# EAGLE design Nixie_noTube_final_R2_1 (EAGLE 7.6.0)
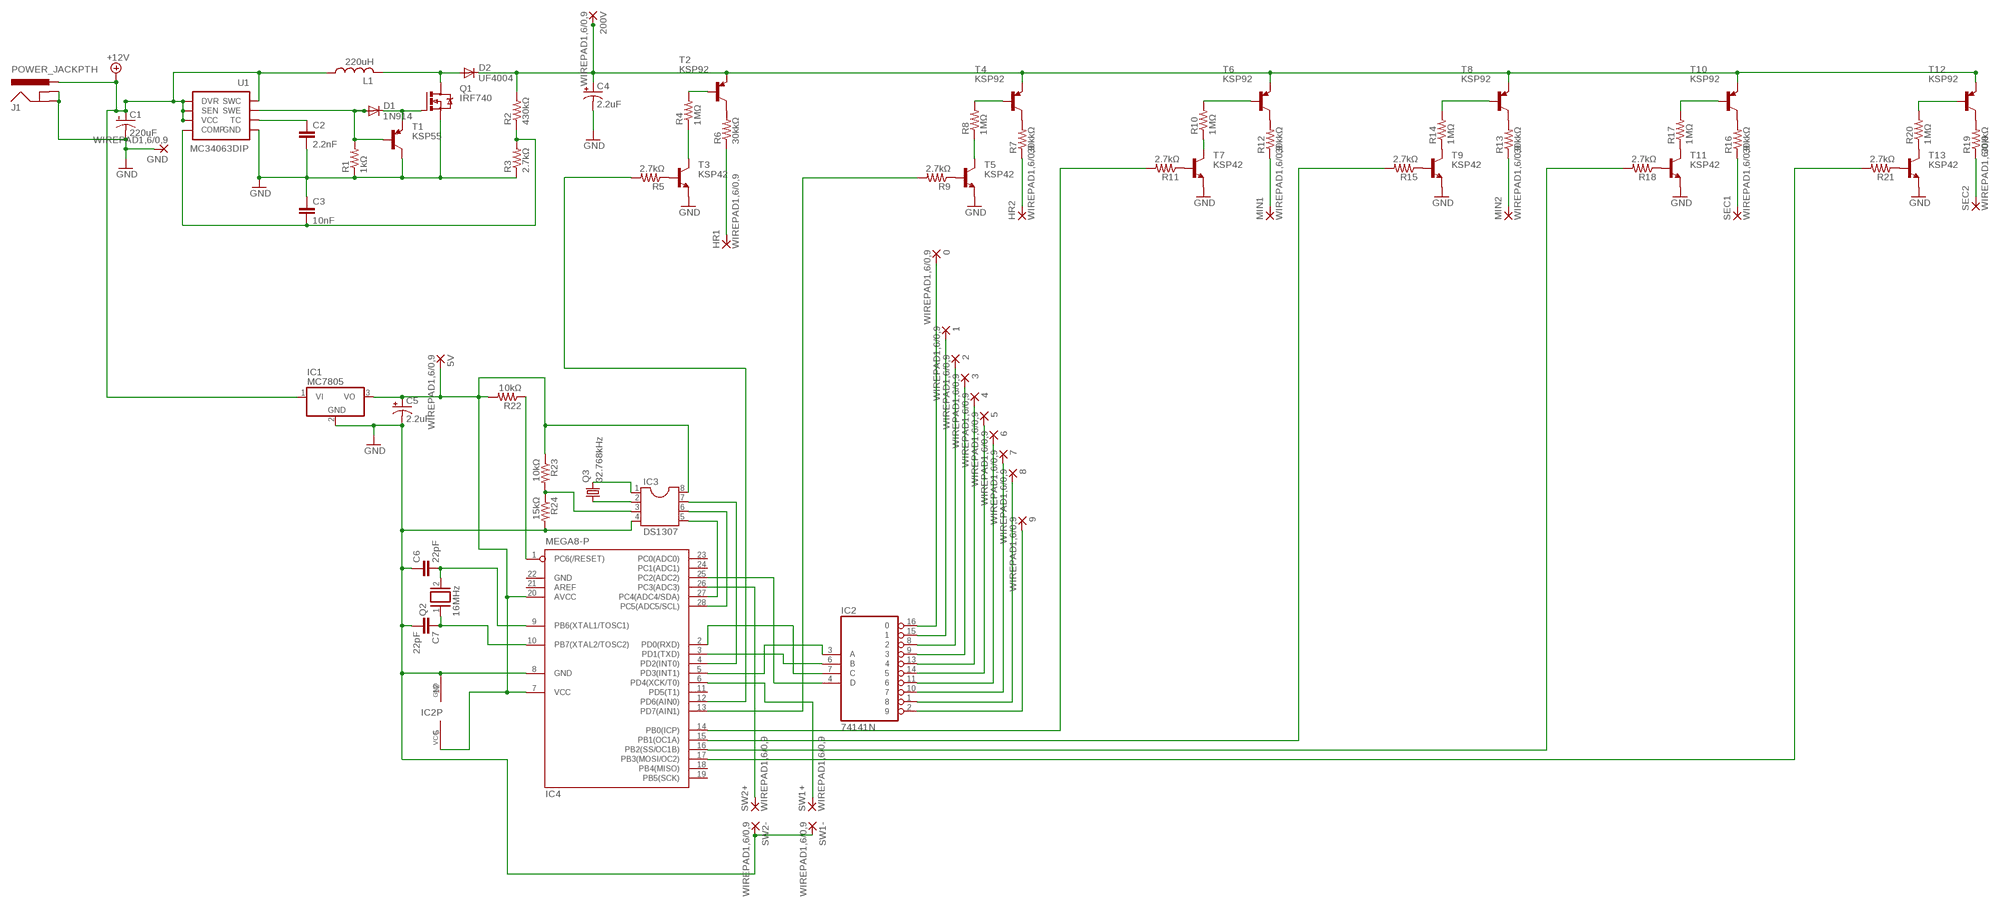
[diagram p0: schematic, sheet 1]

## Parts
0  WIREPAD1,6/0,9  [1,6/0,9]
1  WIREPAD1,6/0,9  [1,6/0,9]
2  WIREPAD1,6/0,9  [1,6/0,9]
3  WIREPAD1,6/0,9  [1,6/0,9]
4  WIREPAD1,6/0,9  [1,6/0,9]
5  WIREPAD1,6/0,9  [1,6/0,9]
5V  WIREPAD1,6/0,9  [1,6/0,9]
6  WIREPAD1,6/0,9  [1,6/0,9]
7  WIREPAD1,6/0,9  [1,6/0,9]
8  WIREPAD1,6/0,9  [1,6/0,9]
9  WIREPAD1,6/0,9  [1,6/0,9]
200V  WIREPAD1,6/0,9  [1,6/0,9]
C1  220uF  CPOL-USE5-10.5  [E5-10,5]
C2  2.2nF  CAPEZ  [CAP-PTH-SMALLEZ]
C3  10nF  CAPEZ  [CAP-PTH-SMALLEZ]
C4  2.2uF  CAP_POLPTH1  [CPOL-RADIAL-100UF-25V]
C5  2.2uF  CAP_POLPTH1  [CPOL-RADIAL-100UF-25V]
C6  22pF  C2,5-3  [C2.5-3]
C7  22pF  C2,5-3  [C2.5-3]
D1  1N914  1N4004  [DO41-10]
D2  UF4004  1N4004  [DO41-10]
GND  WIREPAD1,6/0,9  [1,6/0,9]
HR1  WIREPAD1,6/0,9  [1,6/0,9]
HR2  WIREPAD1,6/0,9  [1,6/0,9]
IC1  MC7805  7805TV  [TO220V]
IC2  74141N  [DIL16]
IC3  DS1307  DIL8  [DIL08]
IC4  MEGA8-P  [DIL28-3]
J1  POWER_JACKPTH  [POWER_JACK_PTH]
L1  220uH  L-US6000-XXX-RC  [6000-XXXX-RC]
MIN1  WIREPAD1,6/0,9  [1,6/0,9]
MIN2  WIREPAD1,6/0,9  [1,6/0,9]
Q1  IRF740  [TO220BV]
Q2  16MHz  XTAL/S  [QS]
Q3  32.768kHz  CRYSTALTC26H  [TC26H]
R1  1kΩ  R-US_0204/7  [0204/7]
R2  430kΩ  R-US_0204/7  [0204/7]
R3  2.7kΩ  R-US_0204/7  [0204/7]
R4  1MΩ  R-US_0204/7  [0204/7]
R5  2.7kΩ  R-US_0204/7  [0204/7]
R6  30kkΩ  R-US_0204/7  [0204/7]
R7  30kkΩ  R-US_0204/7  [0204/7]
R8  1MΩ  R-US_0204/7  [0204/7]
R9  2.7kΩ  R-US_0204/7  [0204/7]
R10  1MΩ  R-US_0204/7  [0204/7]
R11  2.7kΩ  R-US_0204/7  [0204/7]
R12  30kkΩ  R-US_0204/7  [0204/7]
R13  30kkΩ  R-US_0204/7  [0204/7]
R14  1MΩ  R-US_0204/7  [0204/7]
R15  2.7kΩ  R-US_0204/7  [0204/7]
R16  30kkΩ  R-US_0204/7  [0204/7]
R17  1MΩ  R-US_0204/7  [0204/7]
R18  2.7kΩ  R-US_0204/7  [0204/7]
R19  30kkΩ  R-US_0204/7  [0204/7]
R20  1MΩ  R-US_0204/7  [0204/7]
R21  2.7kΩ  R-US_0204/7  [0204/7]
R22  10kΩ  R-US_0204/7  [0204/7]
R23  10kΩ  R-US_0204/7  [0204/7]
R24  15kΩ  R-US_0204/7  [0204/7]
SEC1  WIREPAD1,6/0,9  [1,6/0,9]
SEC2  WIREPAD1,6/0,9  [1,6/0,9]
SW1+  WIREPAD1,6/0,9  [1,6/0,9]
SW1-  WIREPAD1,6/0,9  [1,6/0,9]
SW2+  WIREPAD1,6/0,9  [1,6/0,9]
SW2-  WIREPAD1,6/0,9  [1,6/0,9]
T1  KSP55  -PNP-TO92-EBC  [TO92-EBC]
T2  KSP92  BC328-40-PNP-TO92-EBC  [TO92-EBC]
T3  KSP42  29-NPN-TO92-EBC  [TO92-EBC]
T4  KSP92  BC328-40-PNP-TO92-EBC  [TO92-EBC]
T5  KSP42  29-NPN-TO92-EBC  [TO92-EBC]
T6  KSP92  BC328-40-PNP-TO92-EBC  [TO92-EBC]
T7  KSP42  29-NPN-TO92-EBC  [TO92-EBC]
T8  KSP92  BC328-40-PNP-TO92-EBC  [TO92-EBC]
T9  KSP42  29-NPN-TO92-EBC  [TO92-EBC]
T10  KSP92  BC328-40-PNP-TO92-EBC  [TO92-EBC]
T11  KSP42  29-NPN-TO92-EBC  [TO92-EBC]
T12  KSP92  BC328-40-PNP-TO92-EBC  [TO92-EBC]
T13  KSP42  29-NPN-TO92-EBC  [TO92-EBC]
U1  MC34063DIP  [DIP-08]

## Nets
3V: IC3.3 R23.2 R24.1
5V: 5V.1(P) C5.1(+) IC1.3(VO) IC2.5(VCC) IC3.8 IC4.7(VCC) IC4.20(AVCC) R22.2 R23.1
200V: 200V.1(P) C4.1(+) D2.C R2.2 T2.E T4.E T6.E T8.E T10.E T12.E
+12V: C1.+ IC1.1(VI) J1.PWR L1.1 U1.1(SWC) U1.6(VCC) U1.7(SEN) U1.8(DVR)
GND: C1.- C2.2 C3.1 C4.2(-) C5.2(-) C6.1 C7.2 GND.1(P) IC1.2(GND) IC2.12(GND) IC3.4 IC4.8(GND) J1.GND J1.GNDBREAK Q1.S R1.1 R3.1 R24.2 SW1-.1(P) SW2-.1(P) T1.C T3.E T5.E T7.E T9.E T11.E T13.E U1.4(GND)
H1: HR2.1(P) R7.1
N$1: C2.1 U1.3(TC)
N$2: C3.2 R2.1 R3.2 U1.5(COMP)
N$3: D1.A R1.2 T1.B U1.2(SWE)
N$4: D1.C Q1.G T1.E
N$5: D2.A L1.2 Q1.D
N$6: R19.1 SEC2.1(P)
N$7: R11.1 T7.B
N$8: R6.2 T2.C
N$9: R4.2 T2.B
N$10: R4.1 T3.C
N$11: R5.1 T3.B
N$12: HR1.1(P) R6.1
N$13: R7.2 T4.C
N$14: R9.1 T5.B
N$15: R8.2 T4.B
N$16: R8.1 T5.C
N$17: IC3.1 Q3.2
N$18: R12.2 T6.C
N$19: R10.1 T7.C
N$20: MIN1.1(P) R12.1
N$21: R10.2 T6.B
N$22: R13.2 T8.C
N$23: R14.1 T9.C
N$24: R15.1 T9.B
N$25: R14.2 T8.B
N$26: MIN2.1(P) R13.1
N$27: R16.2 T10.C
N$28: R17.1 T11.C
N$29: R18.1 T11.B
N$30: R17.2 T10.B
N$31: R16.1 SEC1.1(P)
N$32: R19.2 T12.C
N$33: R20.1 T13.C
N$34: R21.1 T13.B
N$35: R20.2 T12.B
N$36: IC3.2 Q3.1
N$37: IC4.1(PC6(/RESET)) R22.1
N$39: IC2.6(B) IC4.3(PD1(TXD))
N$40: C6.2 IC4.9(PB6(XTAL1/TOSC1)) Q2.2
N$41: C7.1 IC4.10(PB7(XTAL2/TOSC2)) Q2.1
N$42: IC2.7(C) IC4.2(PD0(RXD))
N$43: IC2.4(D) IC4.25(PC2(ADC2))
N$44: IC2.3(A) IC4.5(PD3(INT1))
N$45: 0.1(P) IC2.16
N$46: 1.1(P) IC2.15
N$47: 2.1(P) IC2.8
N$48: 3.1(P) IC2.9
N$49: 4.1(P) IC2.13
N$50: 5.1(P) IC2.14
N$51: 6.1(P) IC2.11
N$52: 7.1(P) IC2.10
N$53: 8.1(P) IC2.1
N$54: 9.1(P) IC2.2
N$55: IC4.6(PD4(XCK/T0)) SW1+.1(P)
N$56: IC4.26(PC3(ADC3)) SW2+.1(P)
N$57: IC4.12(PD6(AIN0)) R5.2
N$58: IC4.13(PD7(AIN1)) R9.2
N$59: IC4.14(PB0(ICP)) R11.2
N$60: IC4.15(PB1(OC1A)) R15.2
N$61: IC4.16(PB2(SS/OC1B)) R18.2
N$62: IC4.17(PB3(MOSI/OC2)) R21.2
SCL: IC3.6 IC4.28(PC5(ADC5/SCL))
SDA: IC3.5 IC4.27(PC4(ADC4/SDA))
SQWOUT: IC3.7 IC4.4(PD2(INT0))
Unconnected: IC4.11(PD5(T1)) IC4.18(PB4(MISO)) IC4.19(PB5(SCK)) IC4.21(AREF) IC4.23(PC0(ADC0)) IC4.24(PC1(ADC1))

## Power pins joined to a net without a drawn wire
GND: IC4.22(GND)

## Library data of the parts
0 1-5 5V 6-9 200V GND HR1 HR2 MIN1 MIN2 SEC1 SEC2 SW1+ SW1- SW2+ SW2- = wirepad:WIREPAD: Wire PAD connect wire on PCB
C1 = resistor:CPOL-US: POLARIZED CAPACITOR, American symbol
C2 C3 = SparkFun-Capacitors:CAP: Capacitor Standard 0603 ceramic capacitor, and 0.1" leaded capacitor.
C4 C5 = SparkFun-Capacitors:CAP_POL: Capacitor Polarized These are standard SMD and PTH capacitors. Normally 10uF, 47uF, and 100uF in electrolytic and tantalum varieties. Always verify the external diameter of the through hole cap, it varies with capacity, voltage, and manufacturer. The EIA devices should be standard.
C6 C7 = capacitor-wima:C: CAPACITOR naming: grid - package width
D1 D2 = diode:1N4004: DIODE general purpose rectifier, 1 A
IC1 = linear:78*: Positive VOLTAGE REGULATOR Source: http://cache.national.com/ds/LM/LM78L05.pdf http://www.fairchildsemi.com/ds/LM/LM7805.pdf
IC2 = 74xx-us:74*141: BCD to decimal DECODER/DRIVER
IC3 = ic-package:DIL8: Dual In Line / Socket
IC4 = atmel:MEGA8-P: MICROCONTROLLER 8 Kbytes FLASH, 1 kbytes SRAM, 512 bytes EEPROM, USART, 4-channel 10 bit ADC, 2-channel 8 bit ADC Pin compatible with Atmega48, ATMega88, ATMega168 Source: avr.lbr; OC_FARNELL: unknown; OC_NEWARK: unknown
J1 = SparkFun-Connectors:POWER_JACK: Power Jack This is the standard 5.5mm barrel jack for power. The PTH is the most common, proven, reliable, footprint. The Slot footprint only works if the mill layer is transmitted to the PCB fab house so be warned. Mating wall wart : TOL-00298 (and others); PROD_ID: CONN-08197
L1 = rcl:L-US: INDUCTOR, American symbol
Q1 = transistor-power:IRF740: N-CHANNEL MOS FET
Q2 = special:XTAL/S: CRYSTAL
Q3 = crystal:CRYSTAL: CRYSTAL; OC_FARNELL: unknown; OC_NEWARK: unknown
R1-R24 = resistor:R-US_: RESISTOR, American symbol
T1 = transistor-neu-to92:*-PNP-: PNP Transistror
T2 T4 T6 T8 T10 T12 = transistor:*-PNP-: PNP Transistror
T3 T5 T7 T9 T11 T13 = transistor:*-NPN-: NPN Transistror BF959 corrected 2008.03.06
U1 = SparkFun-PowerIC:MC34063: Jellybean switching supply controller

## Board
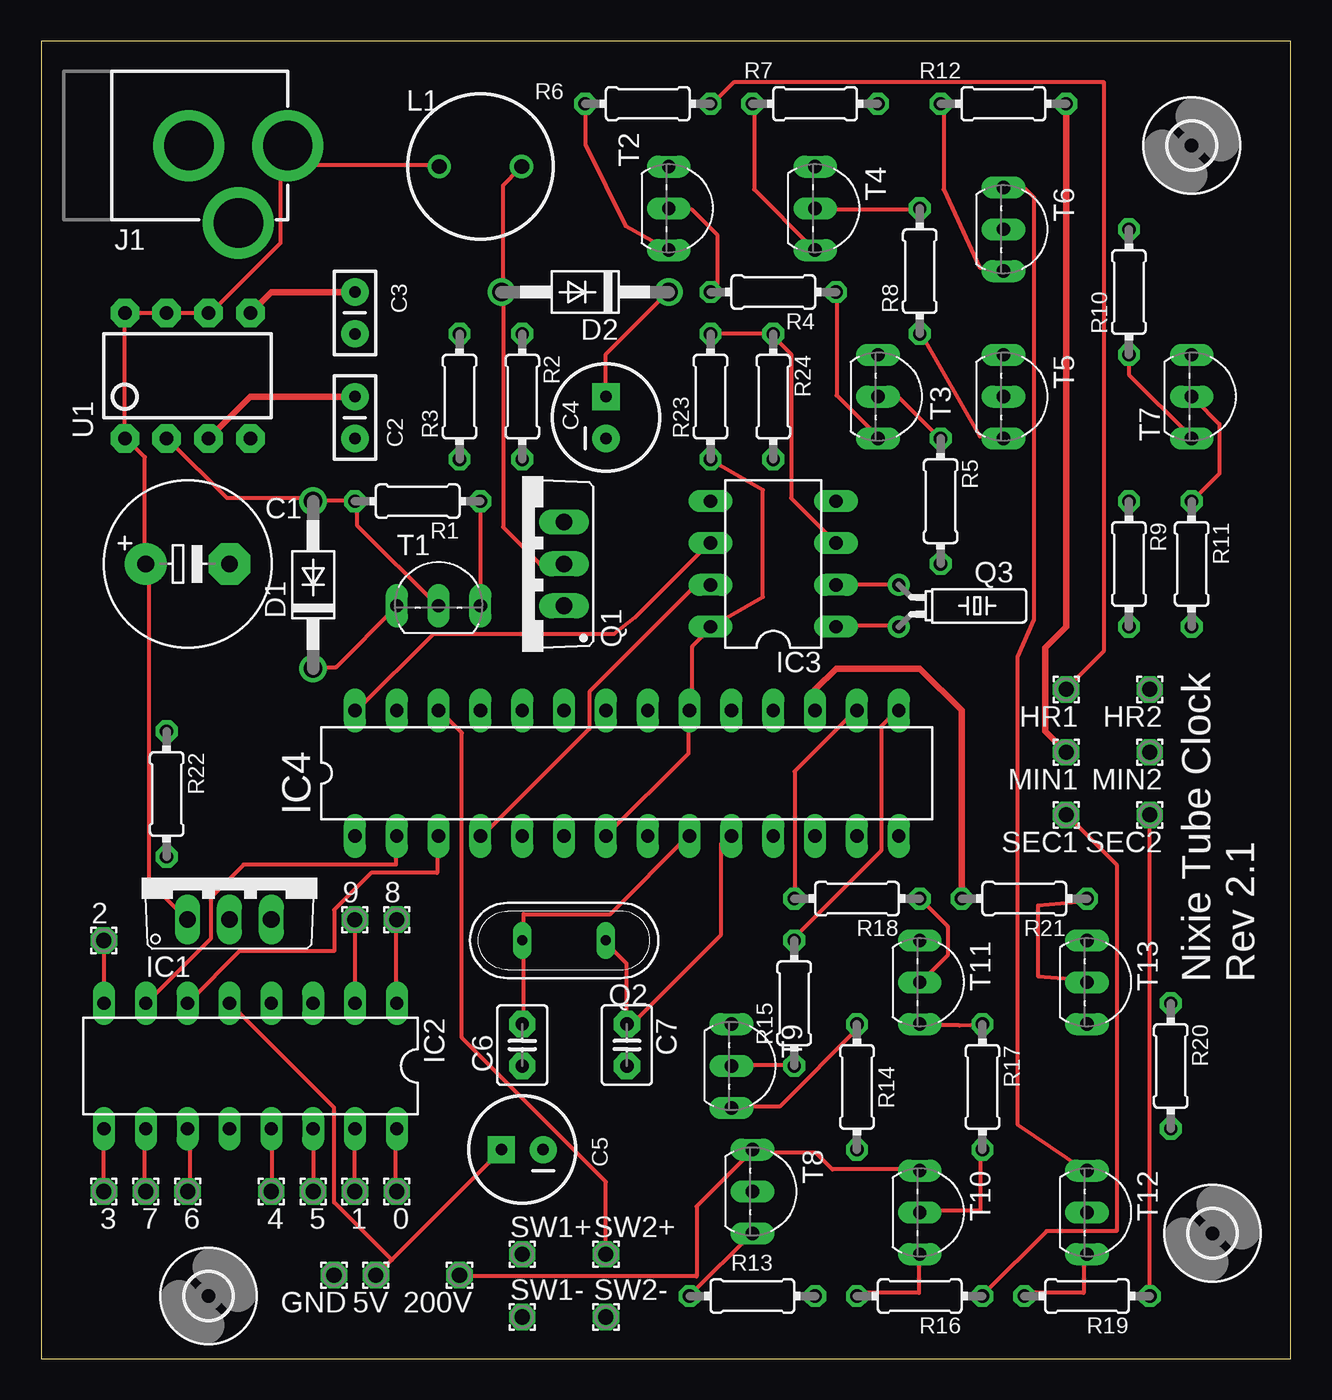
[diagram p1: board, top side]
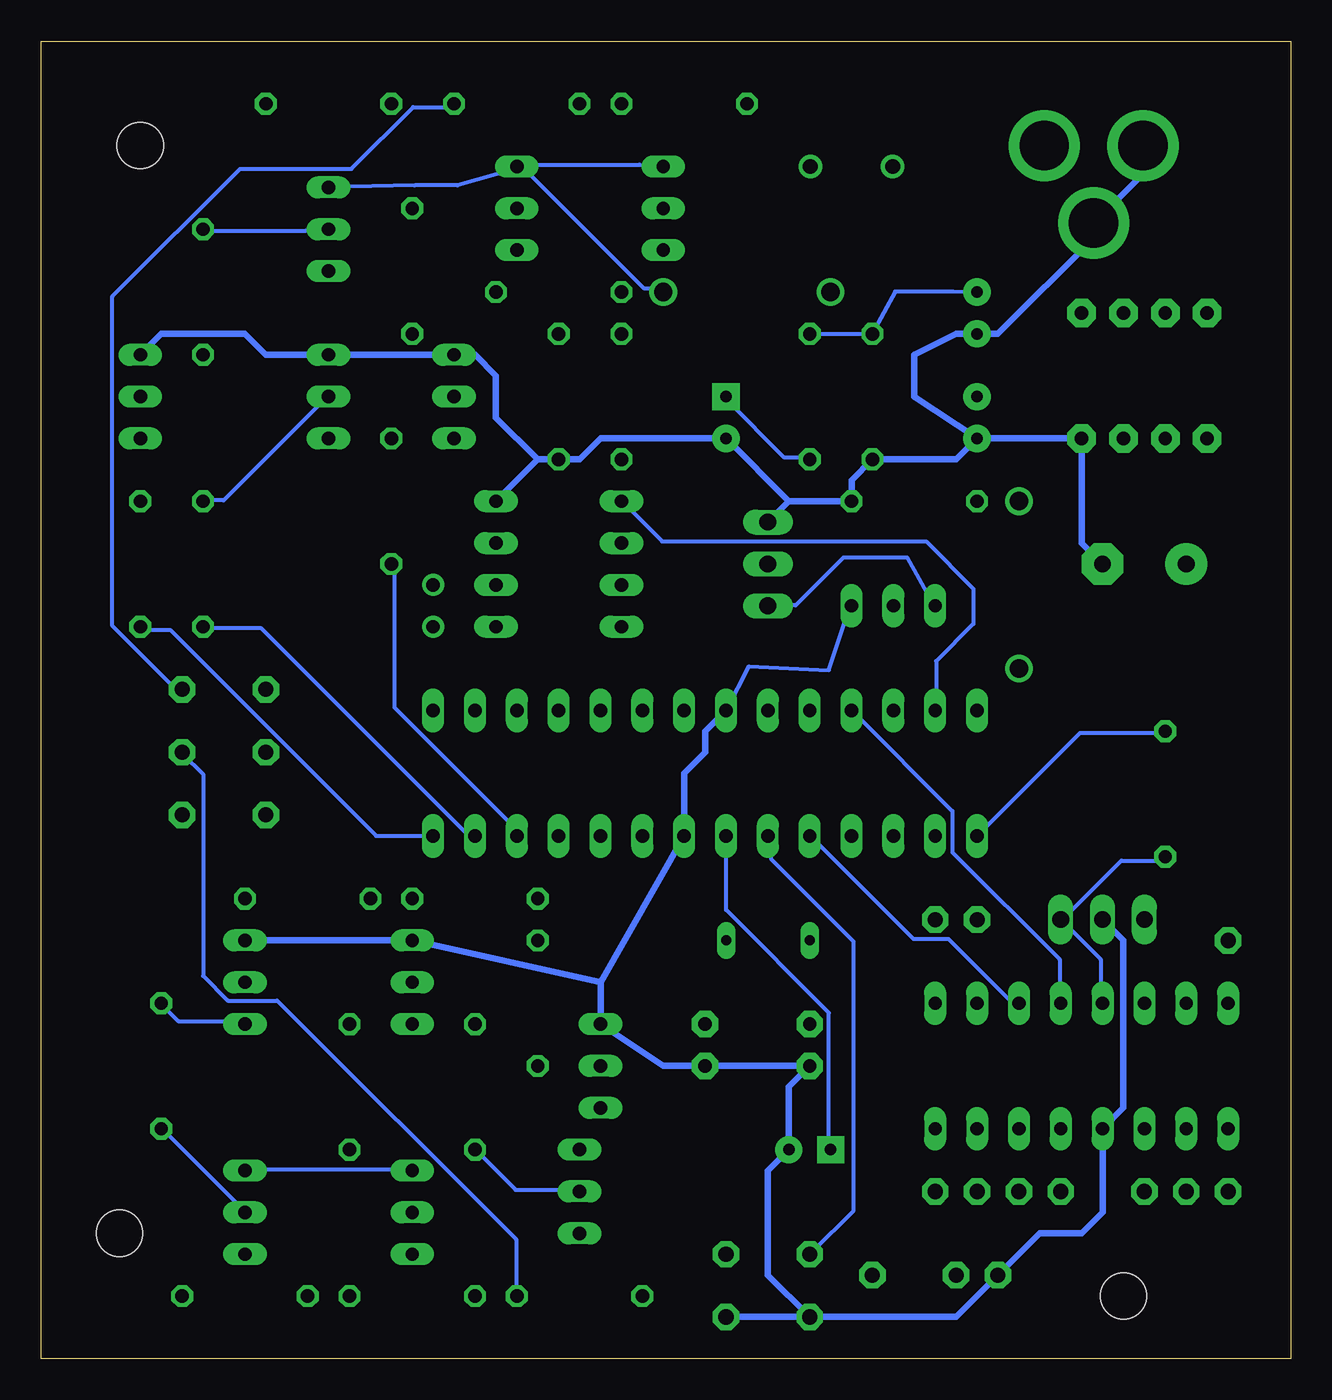
[diagram p2: board, bottom side, seen from below]

Size 75.87 x 80 mm. Coordinates in mm from the lower left corner, seen from the top.
Outline: 0,0 75.87,0 75.87,80 0,80 0,0
Copper layers (1*16): Top 0.035mm / dielectric 1.5mm / Bottom 0.035mm
Design rules "default": minimum track width 10mil, minimum drill 24mil, track to track 8mil, track to pad 8mil, pad to pad 8mil, via to via 8mil, smd to smd 8mil, copper to edge 40mil, drill to drill 8mil, minimum pad ring 10mil, minimum via ring 8mil, stop-mask expansion 4mil, vias tented up to drill 0mil, thermal gap 10mil

### Footprints (pad centres in the part's own frame; a part is rotated, then mirrored left to right if it is on the bottom)
1,6/0,9 = drill 0.914 pad 1.6 octagon: 1 0,0
E5-10,5 = drill 1.016 pad 2.54: + -2.54,0 | drill 1.016 pad 2.54 octagon: - 2.54,0
CAP-PTH-SMALLEZ = drill 0.7 pad 1.651: 1 0,0; 2 2.54,0
CPOL-RADIAL-100UF-25V = drill 0.7 pad 1.651 square: 1 1.27,0 | drill 0.7 pad 1.651: 2 -1.27,0
C2.5-3 = drill 0.813 pad 1.6 octagon: 1 -1.27,0; 2 1.27,0
DO41-10 = drill 1.118: A 5.08,0; C -5.08,0
TO220V = drill 1.016 long: 1 -2.54,-2.54; 2 0,-2.54; 3 2.54,-2.54
DIL16 = drill 0.813 long: 1 -8.89,-3.81; 2 -6.35,-3.81; 3 -3.81,-3.81; 4 -1.27,-3.81; 5 1.27,-3.81; 6 3.81,-3.81; 7 6.35,-3.81; 8 8.89,-3.81; 9 8.89,3.81; 10 6.35,3.81; 11 3.81,3.81; 12 1.27,3.81; 13 -1.27,3.81; 14 -3.81,3.81; 15 -6.35,3.81; 16 -8.89,3.81
DIL08 = drill 0.813 long: 1 -3.81,-3.81; 2 -1.27,-3.81; 3 1.27,-3.81; 4 3.81,-3.81; 5 3.81,3.81; 6 1.27,3.81; 7 -1.27,3.81; 8 -3.81,3.81
DIL28-3 = drill 0.813 long: 1 -16.51,-3.81; 2 -13.97,-3.81; 3 -11.43,-3.81; 4 -8.89,-3.81; 5 -6.35,-3.81; 6 -3.81,-3.81; 7 -1.27,-3.81; 8 1.27,-3.81; 9 3.81,-3.81; 10 6.35,-3.81; 11 8.89,-3.81; 12 11.43,-3.81; 13 13.97,-3.81; 14 16.51,-3.81; 15 16.51,3.81; 16 13.97,3.81; 17 11.43,3.81; 18 8.89,3.81; 19 6.35,3.81; 20 3.81,3.81; 21 1.27,3.81; 22 -1.27,3.81; 23 -3.81,3.81; 24 -6.35,3.81; 25 -8.89,3.81; 26 -11.43,3.81; 27 -13.97,3.81; 28 -16.51,3.81
POWER_JACK_PTH = drill 2.997 pad 4.318: GND 0,7.7; GNDBREAK 4.7,10.7; PWR 0,13.7
6000-XXXX-RC = drill 0.9 pad 1.422: 1 -2.5,0; 2 2.5,0
TO220BV = drill 1.016 long: D 0,-2.54; G -2.54,-2.54; S 2.54,-2.54
QS = drill 0.61 long: 1 -2.54,0; 2 2.54,0
TC26H = drill 0.813: 1 -1.27,0; 2 1.27,0
0204/7 = drill 0.813 octagon: 1 -3.81,0; 2 3.81,0
TO92-EBC = drill 0.813 long: B 0,-1.27; C 2.54,-1.27; E -2.54,-1.27
DIP-08 = drill 0.813 pad 1.727 octagon: 1 -3.81,-3.81; 2 -1.27,-3.81; 3 1.27,-3.81; 4 3.81,-3.81; 5 3.81,3.81; 6 1.27,3.81; 7 -1.27,3.81; 8 -3.81,3.81
2,8 = hole 2.8: 0,0

### Placement (x,y rotation side)
0  21.59,10.16 180 top
1  19.05,10.16 180 top
2  3.81,25.4 0 top
3  3.81,10.16 180 top
4  13.97,10.16 180 top
5  16.51,10.16 180 top
5V  20.32,5.08 180 top
6  8.89,10.16 180 top
7  6.35,10.16 180 top
8  21.59,26.67 0 top
9  19.05,26.67 0 top
200V  25.4,5.08 180 top
C1  8.89,48.26 0 top
C2  19.05,58.42 270 top
C3  19.05,62.23 90 top
C4  34.29,57.15 90 top
C5  29.21,12.7 180 top
C6  29.21,19.05 90 top
C7  35.56,19.05 270 top
D1  16.51,46.99 90 top
D2  33.02,64.77 180 top
GND  17.78,5.08 180 top
HR1  62.23,40.64 180 top
HR2  67.31,40.64 180 top
IC1  11.43,29.21 0 top
IC2  12.7,17.78 180 top
IC3  44.45,48.26 90 top
IC4  35.56,35.56 0 top
J1  1.27,73.66 270 top
L1  26.67,72.39 0 top
MIN1  62.23,36.83 180 top
MIN2  67.31,36.83 180 top
Q1  29.21,48.26 90 top
Q2  31.75,25.4 180 top
Q3  52.07,45.72 270 top
R1  22.86,52.07 180 top
R2  29.21,58.42 270 top
R3  25.4,58.42 90 top
R4  44.45,64.77 180 top
R5  54.61,52.07 270 top
R6  36.83,76.2 180 top
R7  46.99,76.2 180 top
R8  53.34,66.04 90 top
R9  66.04,48.26 270 top
R10  66.04,64.77 90 top
R11  69.85,48.26 270 top
R12  58.42,76.2 180 top
R13  43.18,3.81 180 top
R14  49.53,16.51 270 top
R15  45.72,21.59 90 top
R16  53.34,3.81 180 top
R17  57.15,16.51 270 top
R18  49.53,27.94 180 top
R19  63.5,3.81 180 top
R20  68.58,17.78 270 top
R21  59.69,27.94 180 top
R22  7.62,34.29 270 top
R23  40.64,58.42 90 top
R24  44.45,58.42 270 top
SEC1  62.23,33.02 180 top
SEC2  67.31,33.02 180 top
SW1+  29.21,6.35 0 top
SW1-  29.21,2.54 0 top
SW2+  34.29,6.35 0 top
SW2-  34.29,2.54 0 top
T1  24.13,46.99 0 top
T2  39.37,69.85 270 top
T3  52.07,58.42 270 top
T4  48.26,69.85 270 top
T5  59.69,58.42 270 top
T6  59.69,68.58 270 top
T7  71.12,58.42 270 top
T8  44.45,10.16 270 top
T9  43.18,17.78 270 top
T10  54.61,8.89 270 top
T11  54.61,22.86 270 top
T12  64.77,8.89 270 top
T13  64.77,22.86 270 top
U1  8.89,59.69 0 top
U$1  [2,8]  69.85,73.66 0 top
U$2  [2,8]  10.16,3.81 0 top
U$3  [2,8]  71.12,7.62 0 top

### Tracks (layer width: path | path; a pad name or v marks a point on that pad's centre or on a via)
3V
  Top 0.254: IC3.3 45.54,52.25 45.54,61 44.54,62 R24.1 44.29,62.25 40.79,62.25 R23.2
5V
  Top 0.254: IC4.7 39.29,36.75 39.29,39.25 IC4.20 39.54,39.5 39.54,43.25 40.54,44.25 IC3.8 40.79,44.5 43.81,46.25 43.81,52.75 40.79,54.5 R23.1 | 21.29,6 27.79,12.5 C5.1 | 21.29,6 20.54,5.25 5V.1 | 21.29,6 17.79,9.5 17.79,15.25 11.54,21.5 IC2.5
  Bottom 0.254: IC2.5 11.54,21.75 11.54,24.25 13.79,26.5 IC1.3 13.79,26.75 10.29,30.25 7.79,30.25 R22.2 | IC4.7 34.29,27.25 28.04,21 28.04,12.75 C5.1
200V
  Top 0.254: T10.E 53.29,11.5 48.04,11.5 47.04,12.5 43.29,12.5 T8.E 43.04,12.5 39.79,9.25 39.79,5 25.54,5 200V.1 | C4.1 34.29,61 38.04,64.75 D2.C | T12.E 63.29,11.5 59.27,14.25 59.27,42.61 60.27,44.88 60.27,70.52 59.79,71 T6.E
  Bottom 0.254: T10.E 53.54,11.5 63.29,11.5 T12.E | R2.2 29.29,54.75 30.79,54.75 34.29,58.25 C4.1 | 46.79,72.5 39.54,72.5 T2.E | T6.E 53.19,71.25 50.58,71.25 47.04,72.25 T4.E 46.79,72.5 | 46.79,72.5 39.29,65 38.29,65 D2.C
+12V
  Top 0.254: 15.04,72.5 24.04,72.5 L1.1 | 15.04,72.5 15.04,73.5 J1.PWR 15.04,72.5 | IC1.1 8.79,26.75 6.54,29 6.54,48.25 C1.+ 6.29,48.5 6.29,54.75 5.29,55.75 U1.1 5.04,56 5.04,63.5 U1.8 U1.7 U1.6 10.29,63.5 14.54,67.75 14.54,72 15.04,72.5
GND
  Top 0.254: T1.C 26.66,45.75 26.66,52 R1.1
  Bottom 0.254: T1.C 26.79,45.62 28.04,41.81 32.9,42.04 IC4.22
  Bottom 0.406: IC1.2 10.16,25.4 10.16,15.24 IC2.12 11.43,8.89 12.7,7.62 15.24,7.62 GND.1 20.32,2.54 SW1-.1 | SW2-.1 SW1-.1 | SW1-.1 31.75,5.08 31.75,11.43 C5.2 30.48,16.51 C6.1 C7.2 38.1,17.78 T9.E 41.91,22.86 | 41.91,22.86 T11.E T13.E | 41.91,22.86 IC4.8 36.83,35.56 35.56,36.83 35.56,38.1 IC4.22 | J1.GND 8.97,71.96 J1.GNDBREAK 11.97,68.04 17.78,62.23 C3.1 20.32,62.23 22.86,60.96 22.86,58.42 C2.2 | C2.2 20.32,54.61 R3.1 26.67,53.34 R1.1 30.48,52.07 | C2.2 U1.4 12.7,49.53 C1.- | 30.48,52.07 C4.2 41.91,55.88 43.18,54.61 R24.2 45.72,54.61 | Q1.S 30.48,52.07 | 45.72,54.61 IC3.4 | 45.72,54.61 48.26,57.15 48.26,59.69 49.53,60.96 T3.E T5.E 62.23,60.96 63.5,62.23 68.58,62.23 T7.E
H1
  Bottom 0.254: R7.1 51.04,76 53.29,76 57.04,72.25 63.79,72.25 71.54,64.5 71.54,44.5 67.54,40.5 HR2.1
N$1
  Top 0.406: U1.3 12.7,58.42 C2.1
N$2
  Top 0.406: U1.5 13.97,64.77 C3.2
  Bottom 0.254: R2.1 29.04,62.25 25.54,62.25 R3.2 24.02,64.79 20.52,64.79 19.29,64.75 C3.2
N$3
  Top 0.254: U1.2 7.79,55.75 11.29,52.25 16.29,52.25 D1.A 16.54,52.12 19.04,52.12 R1.2 19.16,52 19.16,50.62 24.04,45.75 T1.B
N$4
  Top 0.254: 16.54,42 D1.C 16.66,42 17.91,42 21.54,45.62 T1.E
  Bottom 0.254: Q1.G 31.66,45.75 30.06,45.75 27.16,48.65 23.29,48.65 21.66,45.75 T1.E
N$5
  Top 0.254: L1.2 29.04,72.25 28.04,71.25 28.04,65 D2.A 28.04,64.75 28.04,50.5 30.27,48.27 Q1.D
N$6
  Top 0.254: R19.1 67.29,4 67.29,33 SEC2.1
N$7
  Top 0.254: R11.1 70.04,52.25 71.54,53.75 71.54,56.75 70.04,58.25 T7.B
N$8
  Top 0.254: T2.C 35.48,68.77 33.04,73.75 33.04,76 R6.2
N$9
  Top 0.254: R4.2 40.79,65 41.04,65.25 41.04,68.25 39.54,69.75 T2.B
N$10
  Top 0.254: T3.C 50.79,56 48.29,58.5 48.29,64.75 R4.1
N$11
  Top 0.254: T3.B 51,58.29 52.15,58.29 54.43,56.01 R5.1
N$12
  Top 0.254: R6.1 40.79,76.25 42.04,77.5 64.54,77.5 64.54,43 62.29,40.75 HR1.1
N$13
  Top 0.254: T4.C 46.79,67.5 43.29,71 43.29,76 R7.2
N$14
  Bottom 0.254: R9.1 66.04,52.12 64.79,52.12 58.54,58.38 T5.B
N$15
  Top 0.254: T4.B 47.04,69.75 53.29,69.75 R8.2
N$16
  Top 0.254: R8.1 53.54,62 57,56 T5.C
N$17
  Top 0.254: IC3.1 48.29,44.5 52.04,44.5 Q3.2
N$18
  Top 0.254: T6.C 57,66.25 54.79,71 54.79,76 R12.2
N$19
  Top 0.254: R10.1 66.04,59.75 69.79,56 T7.C
N$20
  Top 0.406: R12.1 62.23,44.45 60.96,43.18 60.96,38.1 MIN1.1
N$21
  Bottom 0.254: T6.B 59.79,68.5 66.04,68.5 R10.2
N$22
  Top 0.254: R13.2 39.54,4 43.04,7.5 T8.C
N$23
  Top 0.254: T9.C 42.09,15.32 44.83,15.32 49.63,20.12 R14.1
N$24
  Top 0.254: T9.B 42.09,17.83 45.52,17.83 R15.1
N$25
  Bottom 0.254: T8.B 43.29,10.25 47.06,10.25 49.31,12.5 R14.2
N$26
  Bottom 0.254: R13.1 47.04,4 47.04,7.25 61.54,21.75 64.54,21.75 66.04,23.25 66.04,35.5 67.29,36.75 MIN2.1
N$27
  Top 0.254: R16.2 49.54,4 53.29,4 53.29,6.25 T10.C
N$28
  Top 0.254: T11.C 53.54,20.25 55.75,20.25 R17.1
N$29
  Top 0.254: T11.B 53.54,23 55.04,24.5 55.04,26.25 53.54,27.75 R18.1
N$30
  Top 0.254: T10.B 53.54,9 57.02,9 57.02,12.5 R17.2
N$31
  Top 0.254: R16.1 57.29,4 61.04,7.75 65.29,7.75 65.29,30 62.29,33 SEC1.1
N$32
  Top 0.254: R19.2 59.79,4 63.29,4 63.29,6.25 T12.C
N$33
  Bottom 0.254: T13.C 63.54,20.5 67.54,20.5 68.54,21.5 R20.1
N$34
  Top 0.254: T13.B 63.29,23 60.52,23.23 60.52,27.52 63.29,27.75 R21.1
N$35
  Bottom 0.254: T12.B 63.54,9 68.54,14 R20.2
N$36
  Top 0.254: IC3.2 48.29,47 52.04,47 Q3.1
N$37
  Bottom 0.254: R22.1 7.79,38 12.79,38 IC4.1
N$39
  Top 0.254: IC2.6 9.04,21.75 12.04,24.75 17.79,24.75 17.79,27.25 20.04,29.5 24.04,29.5 24.04,31.75 IC4.3
N$40
  Top 0.254: C6.2 29.29,20.5 29.29,25.25 Q2.2 29.29,25.5 29.29,27 34.54,27 39.29,31.75 IC4.9
N$41
  Top 0.254: Q2.1 34.29,25.25 35.54,24 35.54,20.5 C7.1 35.79,20.25 41.29,25.75 41.29,31.25 41.79,31.75 IC4.10
N$42
  Top 0.254: IC2.7 6.54,21.75 10.29,25.5 10.29,28 12.29,30 21.54,30 21.54,31.75 IC4.2
N$43
  Bottom 0.254: IC2.4 14.04,21.75 14.04,24.25 20.54,30.75 20.54,33.25 26.54,39.25 IC4.25
N$44
  Bottom 0.254: 16.54,21.75 IC2.3 16.66,21.75 17.04,21.75 20.79,25.5 22.91,25.5 29.16,31.75 IC4.5
N$45
  Top 0.254: IC2.16 21.54,13.75 21.54,10.25 0.1
N$46
  Top 0.254: IC2.15 19.04,13.75 19.04,10.25 1.1
N$47
  Top 0.254: IC2.8 3.79,21.75 3.79,25.25 2.1
N$48
  Top 0.254: IC2.9 3.79,13.75 3.79,10.25 3.1
N$49
  Top 0.254: IC2.13 14.04,13.75 14.04,10.25 4.1
N$50
  Top 0.254: IC2.14 16.54,13.75 16.54,10.25 5.1
N$51
  Top 0.254: IC2.11 9.04,13.75 9.04,10.25 6.1
N$52
  Top 0.254: IC2.10 6.29,13.75 6.29,10.25 7.1
N$53
  Top 0.254: IC2.1 21.54,21.75 21.54,26.5 8.1
N$54
  Top 0.254: IC2.2 19.04,21.75 19.04,26.5 9.1
N$55
  Bottom 0.254: IC4.6 31.54,31.75 31.54,30.33 26.54,25.33 26.54,9 29.04,6.5 SW1+.1
N$56
  Top 0.254: SW2+.1 34.29,10.75 25.54,19.5 25.54,38 24.29,39.25 IC4.26
N$57
  Bottom 0.254: IC4.12 47.12,31.77 47.12,32.23 54.43,39.55 54.43,48.23 R5.2
N$58
  Bottom 0.254: IC4.13 49.91,31.75 62.54,44.38 66.04,44.38 R9.2
N$59
  Bottom 0.254: IC4.14 55.54,31.75 68.04,44.25 69.79,44.25 R11.2
N$60
  Top 0.254: R15.2 45.74,25.6 51,30.86 51,38.41 51.92,39.32 IC4.15
N$61
  Top 0.254: R18.2 45.74,28.12 45.74,35.66 49.4,39.32 IC4.16
  Bottom 0.254: 45.79,28 R18.2
N$62
  Top 0.406: IC4.17 46.99,40.64 48.26,41.91 53.34,41.91 55.88,39.37 R21.2
SCL
  Top 0.254: IC4.28 19.16,39.38 23.79,44 34.77,44 36.04,45 40.54,49.5 IC3.6
SDA
  Top 0.254: 21.54,39.25 IC4.27 | 40.54,52 IC3.5
  Bottom 0.254: IC4.27 21.54,39.38 21.54,42.35 19.27,44.62 19.27,46.75 22.14,49.62 38.16,49.62 40.54,52 IC3.5
SQWOUT
  Top 0.254: IC4.4 26.79,31.75 33.29,38.25 33.29,40.5 39.66,46.88 40.54,46.88 IC3.7

### Text on the board
tNames: Nixie Tube Clock / Rev 2.1